# Altium schematic sheet Microcontroller.SchDoc
size A; Organization: Machine Intelligence Laboratory; Address1: 1889 Museum Rd; Address2: Room 3001; Address3: Gainesville, FL, 32611; SheetNumber: 2; SheetTotal: 4
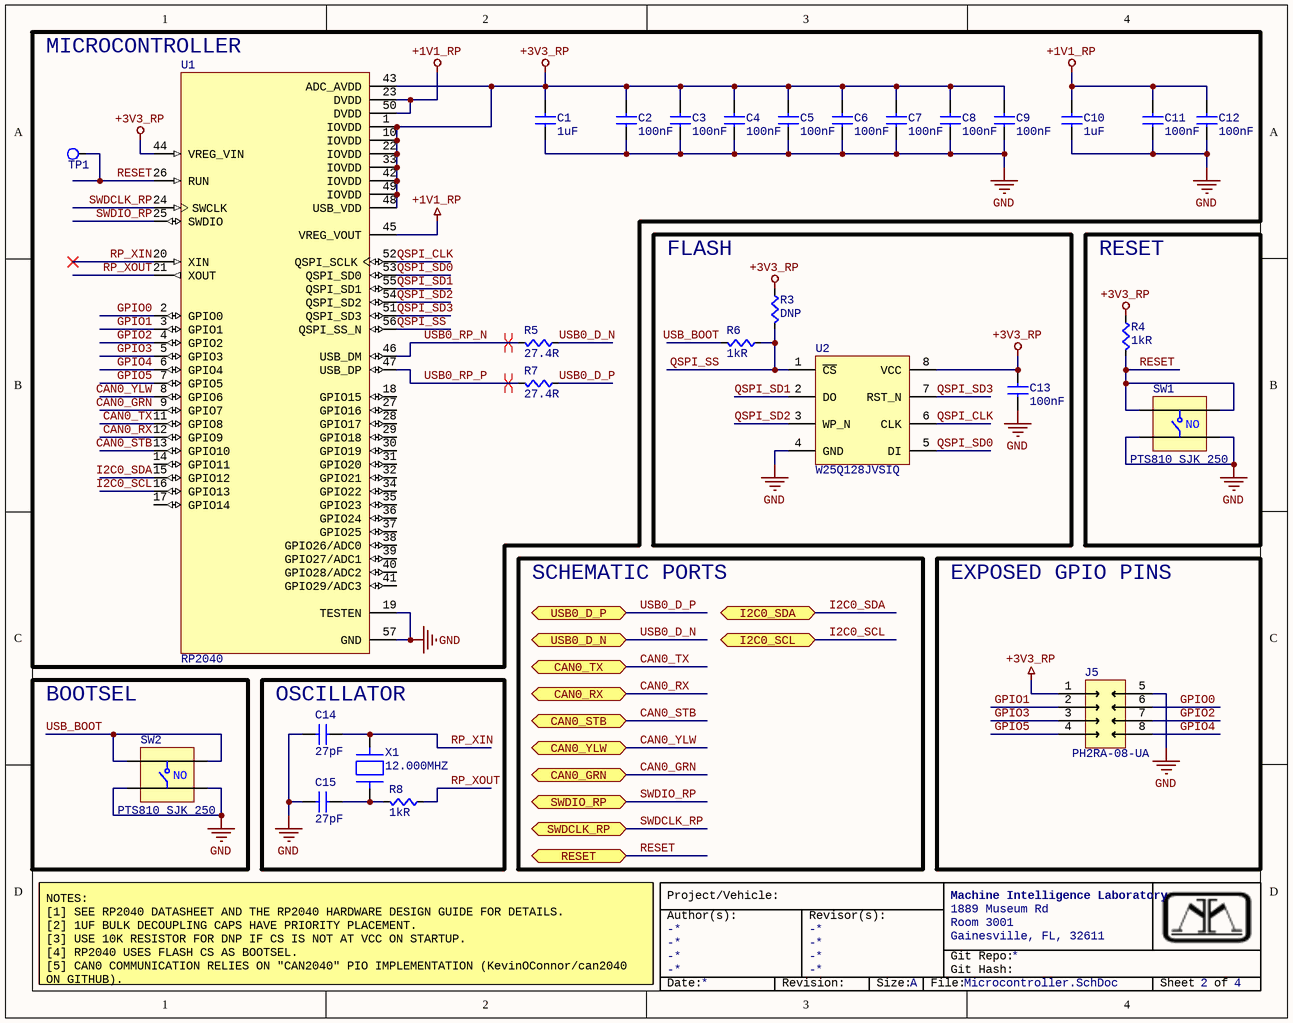
[diagram p0: Microcontroller.SchDoc]

## Parts
C1  1uF  [CAPC0603]
C2  100nF  [CAPC0603]
C3  100nF  [CAPC0603]
C4  100nF  [CAPC0603]
C5  100nF  [CAPC0603]
C6  100nF  [CAPC0603]
C7  100nF  [CAPC0603]
C8  100nF  [CAPC0603]
C9  100nF  [CAPC0603]
C10  1uF  [CAPC0603]
C11  100nF  [CAPC0603]
C12  100nF  [CAPC0603]
C13  100nF  [CAPC0603]
C14  27pF  [CAPC0603]
C15  27pF  [CAPC0603]
J5  PH2RA-08-UA  [PH2RA-08-UA]
R3  value DNP  [RES0603]  (hidden comment: Res)
R4  1kR  [RES0603]
R5  27.4R  [RES0603]
R6  1kR  [RES0603]
R7  27.4R  [RES0603]
R8  1kR  [RES0603]
SW1  PTS810 SJK 250  [SW_PTS810_SJM_250_SMTR_LFS]
SW2  PTS810 SJK 250  [SW_PTS810_SJM_250_SMTR_LFS]
TP1  TP  [TPAD-60MIL]  (value not drawn)  (no BOM)
U1  RP2040  [QFN40P700X700X90-57N]
U2  W25Q128JVSIQ  [SOIC127P790X216-8N]
X1  12.000MHZ  [ABLS-12.000MHZ]

## Blocks framed on the sheet
MICROCONTROLLER: C1-C12 R5 R7 TP1 U1
FLASH: C13 R3 R6 U2
RESET: R4 SW1
EXPOSED GPIO PINS: J5
BOOTSEL: SW2
OSCILLATOR: C14 C15 R8 X1

## Ports
CAN0_GRN (bidir, see Connectors[8A], Transceivers[3A]), CAN0_RX (bidir, see Transceivers[3A]), CAN0_STB (bidir, see Transceivers[3A]), CAN0_TX (bidir, see Transceivers[3A]), CAN0_YLW (bidir, see Connectors[8B], Transceivers[3A]), I2C0_SCL (bidir, see Connectors[8A]), I2C0_SDA (bidir, see Connectors[8A]), RESET (bidir, see Connectors[8A]), SWDCLK_RP (bidir, see Connectors[8A]), SWDIO_RP (bidir, see Connectors[8A]), USB0_D_N (bidir, see Connectors[8A]), USB0_D_P (bidir, see Connectors[8B])

## Nets
+1V1_RP: C10.2(B) C11.2(B) C12.2(B) U1.23(DVDD) U1.45(VREG_VOUT) U1.50(DVDD)
+3V3_RP: C1.2(B) C2.2(B) C3.2(B) C4.2(B) C5.2(B) C6.2(B) C7.2(B) C8.2(B) C9.2(B) C13.2(B) J5.1 R3.2(B) R4.2(B) U1.1(IOVDD) U1.10(IOVDD) U1.22(IOVDD) U1.33(IOVDD) U1.42(IOVDD) U1.43(ADC_AVDD) U1.44(VREG_VIN) U1.48(USB_VDD) U1.49(IOVDD) U2.8(VCC)
GND: C1.1(A) C2.1(A) C3.1(A) C4.1(A) C5.1(A) C6.1(A) C7.1(A) C8.1(A) C9.1(A) C10.1(A) C11.1(A) C12.1(A) C13.1(A) C14.1(A) C15.1(A) J5.5 SW1.3 SW1.4 SW2.3 SW2.4 U1.19(TESTEN) U1.57(GND) U2.4(GND)
CAN0_GRN: U1.9(GPIO7) ; port CAN0_GRN
CAN0_RX: U1.12(GPIO9) ; port CAN0_RX
CAN0_STB: U1.13(GPIO10) ; port CAN0_STB
CAN0_TX: U1.11(GPIO8) ; port CAN0_TX
CAN0_YLW: U1.8(GPIO6) ; port CAN0_YLW
GPIO0: J5.6 U1.2(GPIO0)
GPIO1: J5.2 U1.3(GPIO1)
GPIO2: J5.7 U1.4(GPIO2)
GPIO3: J5.3 U1.5(GPIO3)
GPIO4: J5.8 U1.6(GPIO4)
GPIO5: J5.4 U1.7(GPIO5)
I2C0_SCL: U1.16(GPIO13) ; port I2C0_SCL
I2C0_SDA: U1.15(GPIO12) ; port I2C0_SDA
QSPI_CLK: U1.52(QSPI_SCLK) U2.6(CLK)
QSPI_SD0: U1.53(QSPI_SD0) U2.5(DI)
QSPI_SD1: U1.55(QSPI_SD1) U2.2(DO)
QSPI_SD2: U1.54(QSPI_SD2) U2.3(WP_N)
QSPI_SD3: U1.51(QSPI_SD3) U2.7(RST_N)
QSPI_SS: R3.1(A) R6.2(B) U1.56(QSPI_SS_N) U2.1(~{CS})
RESET: R4.1(A) SW1.1 SW1.2 TP1.1 U1.26(RUN) ; port RESET
RP_XIN: C14.2(B) U1.20(XIN) X1.2
RP_XOUT: R8.2(B) U1.21(XOUT)
SWDCLK_RP: U1.24(SWCLK) ; port SWDCLK_RP
SWDIO_RP: U1.25(SWDIO) ; port SWDIO_RP
USB0_D_N: R5.2(B) ; port USB0_D_N
USB0_D_P: R7.2(B) ; port USB0_D_P
USB0_RP_N: R5.1(A) U1.46(USB_DM)
USB0_RP_P: R7.1(A) U1.47(USB_DP)
USB_BOOT: R6.1(A) SW2.1 SW2.2
NetC15_2: C15.2(B) R8.1(A) X1.1

Not connected (* = marked no-connect by the designer): U1 14(GPIO11) 17(GPIO14) 18(GPIO15) 27(GPIO16) 28(GPIO17) 29(GPIO18) 30(GPIO19) 31(GPIO20) 32(GPIO21) 34(GPIO22) 35(GPIO23) 36(GPIO24) 37(GPIO25) 38(GPIO26/ADC0) 39(GPIO27/ADC1) 40(GPIO28/ADC2) 41(GPIO29/ADC3)

## Layout directives
differential pair; net class USB0_RP; differential pair class USB0_RP_LINES; rule Matched Net Lengths [Tolerance = 10mil]; rule Differential Pairs Routing [Pref Gap = 4mil    Min Gap  = 4mil    Max Gap  = 5milPref Width = 6mil    Min Width  = 5mil    Max Width  = 6mil]: USB0_RP_N, USB0_RP_P

## Notes on the sheet
- SCHEMATIC PORTS
- NOTES:
  [1] SEE RP2040 DATASHEET AND THE RP2040 HARDWARE DESIGN GUIDE FOR DETAILS.
  [2] 1UF BULK DECOUPLING CAPS HAVE PRIORITY PLACEMENT.
  [3] USE 10K RESISTOR FOR DNP IF CS IS NOT AT VCC ON STARTUP.
  [4] RP2040 USES FLASH CS AS BOOTSEL.
  [5] CAN0 COMMUNICATION RELIES ON "CAN2040" PIO IMPLEMENTATION (KevinOConnor/can2040 ON GITHUB).
- Project/Vehicle:
- PLACE NOTES BOX HERE
- Author(s):
- -
- Revisor(s):
- Git Repo:
- Git Hash:
- Date:
- Revision:
- Size:
- A
- File:
- Sheet
- of
- (in symbol PTS810 SJK 250 SMTR LFS) NO

## Library data of the parts
C1 C10 = CC0603KRX7R7BB105: Ceramic Capacitor, Multilayer, Cera; Manufacturer: Yageo; Multilayer: Yes; Tolerance  (fill in as +-): 10%; Rated DC Voltage (URdc): 16V; Temperature Characteristics Code: X7R; Part Number: CC0603KRX7R7BB105; Category: Ceramic Capacitors; Stock 1: 9695416; Pricing 1: 1=0.1, 10=0.066, 50=0.0392, 100=0.0; Mounting Technology: Surface Mount; Pins: 2; Package Shape: Rectangular; Case/Package: 0603; Terminal Finish: Nickel; Min Operating Temperature: -55°C; Max Operating Temperature: 125°C; JESD-609 Code: e3; Packaging: Tape and Reel; Value: 1uF; Termination: Wraparound; Reach SVHC Compliant: Yes; RoHS Compliant: Yes; ComponentLink1URL: https://datasheet.ciiva.com:443/pdf; ComponentLink1Description: https://datasheet.ciiva.com:443/pdf; ComponentLink2URL: https://datasheet.ciiva.com/8033/17; ComponentLink2Description: https://datasheet.ciiva.com/8033/17; ComponentLink3URL: https://datasheet.ciiva.com/8033/17; ComponentLink3Description: https://datasheet.ciiva.com/8033/17; ComponentLink4URL: https://datasheet.ciiva.com/7978/14; ComponentLink4Description: https://datasheet.ciiva.com/7978/14; ComponentLink5URL: https://datasheet.ciiva.com/28450/1; ComponentLink5Description: https://datasheet.ciiva.com/28450/1; ComponentLink6URL: https://datasheet.ciiva.com/176/mlc; ComponentLink6Description: https://datasheet.ciiva.com/176/mlc; ComponentLink7URL: https://datasheet.ciiva.com/176/mlc; ComponentLink7Description: https://datasheet.ciiva.com/176/mlc; ComponentLink8URL: https://datasheet.ciiva.com/176/mlc; ComponentLink8Description: https://datasheet.ciiva.com/176/mlc; ComponentLink9URL: https://datasheet.ciiva.com/5425/up; ComponentLink9Description: https://datasheet.ciiva.com/5425/up; Supplier Part Number 1: 311-1446-1-ND; Manufacturer Part Number: CC0603KRX7R7BB105; RoHS: Yes; Package Style: SMTMeter; Supplier 1: Digikey; Dielectric Material: Ceramic; Capacitor Type: Ceramic; Tolerance (fill in as +-): 10%; Length: 1.6mm; Width: 0.8mm; Height: 0.8mm
C2-C9 C11-C13 = CC0603KRX7R7BB104: Ceramic Capacitor, Multilayer, Cera; Manufacturer: Yageo; Multilayer: Yes; Tolerance  (fill in as +-): 10%; Rated DC Voltage (URdc): 16V; Temperature Characteristics Code: X7R; Part Number: CC0603KRX7R7BB104; Category: Ceramic Capacitors; Stock 1: 11347706; Pricing 1: 1=0.1, 10=0.042, 50=0.0238, 100=0.0; Mounting Technology: Surface Mount; Pins: 2; Package Shape: Rectangular; Case/Package: 0603; Terminal Finish: Nickel; Min Operating Temperature: -55°C; Max Operating Temperature: 125°C; JESD-609 Code: e3; Packaging: Tape and Reel; Value: 100nF; Termination: Wraparound; Reach SVHC Compliant: Yes; RoHS Compliant: Yes; ComponentLink1URL: https://datasheet.ciiva.com:443/pdf; ComponentLink1Description: https://datasheet.ciiva.com:443/pdf; ComponentLink2URL: https://datasheet.ciiva.com/11786/0; ComponentLink2Description: https://datasheet.ciiva.com/11786/0; ComponentLink3URL: https://datasheet.ciiva.com/8033/70; ComponentLink3Description: https://datasheet.ciiva.com/8033/70; ComponentLink4URL: https://datasheet.ciiva.com/7978/14; ComponentLink4Description: https://datasheet.ciiva.com/7978/14; ComponentLink5URL: https://datasheet.ciiva.com/28450/1; ComponentLink5Description: https://datasheet.ciiva.com/28450/1; ComponentLink6URL: https://datasheet.ciiva.com/46430/1; ComponentLink6Description: https://datasheet.ciiva.com/46430/1; ComponentLink7URL: https://datasheet.ciiva.com/144/mlc; ComponentLink7Description: https://datasheet.ciiva.com/144/mlc; ComponentLink8URL: https://datasheet.ciiva.com/144/mlc; ComponentLink8Description: https://datasheet.ciiva.com/144/mlc; ComponentLink9URL: https://datasheet.ciiva.com/144/mlc; ComponentLink9Description: https://datasheet.ciiva.com/144/mlc; Supplier Part Number 1: 311-1088-1-ND; Manufacturer Part Number: CC0603KRX7R7BB104; RoHS: Yes; Package Style: SMTMeter; Supplier 1: Digikey; Dielectric Material: Ceramic; Capacitor Type: Ceramic; Tolerance (fill in as +-): 10%; Length: 1.6mm; Width: 0.8mm; Height: 0.8mm; ComponentLink10URL: https://datasheet.ciiva.com/8033/17; ComponentLink10Description: https://datasheet.ciiva.com/8033/17; ComponentLink11URL: https://datasheet.ciiva.com/13395/u; ComponentLink11Description: https://datasheet.ciiva.com/13395/u; ComponentLink12URL: https://datasheet.ciiva.com/11464/u; ComponentLink12Description: https://datasheet.ciiva.com/11464/u; ComponentLink13URL: https://datasheet.ciiva.com/15165/g; ComponentLink13Description: https://datasheet.ciiva.com/15165/g; ComponentLink14URL: https://datasheet.ciiva.com:443/pdfs/VipMasterIC/IC/YAGO/YAGO-S-A0003557223; ComponentLink14Description: https://datasheet.ciiva.com:443/pdfs/VipMasterIC/IC/YAGO/YAGO-S-A0003557223; ComponentLink15URL: https://datasheet.ciiva.com/11786/0900766b80d84f1d-11786077.pdf?src-supplie; ComponentLink15Description: https://datasheet.ciiva.com/11786/0900766b80d84f1d-11786077.pdf?src-supplie; ComponentLink16URL: https://datasheet.ciiva.com/8033/70765-8033799.pdf?src-supplier=Element14; ComponentLink16Description: https://datasheet.ciiva.com/8033/70765-8033799.pdf?src-supplier=Element14; ComponentLink17URL: https://datasheet.ciiva.com/7978/1489800-7978141.pdf?src-supplier=Element14; ComponentLink17Description: https://datasheet.ciiva.com/7978/1489800-7978141.pdf?src-supplier=Element14; ComponentLink18URL: https://datasheet.ciiva.com/28450/1489800-28450552.pdf?src-supplier=Element
C14 C15 = CC0603JRNPO9BN270: Ceramic Capacitor, Multilayer, Cera; Manufacturer: Yageo; Multilayer: Yes; Tolerance  (fill in as +-): 5%; Rated DC Voltage (URdc): 50V; Temperature Characteristics Code: C0G; Part Number: CC0603JRNPO9BN270; Category: Ceramic Capacitors; Stock 1: 110865; Pricing 1: 1=0.1, 10=0.033, 50=0.0188, 100=0.0; Mounting Technology: Surface Mount; Pins: 2; Package Shape: Rectangular; Case/Package: 0603; Terminal Finish: Nickel; Min Operating Temperature: -55°C; Max Operating Temperature: 125°C; JESD-609 Code: e3; Packaging: Tape and Reel; Value: 27pF; Termination: Wraparound; Reach SVHC Compliant: Yes; RoHS Compliant: Yes; ComponentLink1URL: https://datasheet.ciiva.com:443/pdf; ComponentLink1Description: https://datasheet.ciiva.com:443/pdf; ComponentLink2URL: https://datasheet.ciiva.com/26862/g; ComponentLink2Description: https://datasheet.ciiva.com/26862/g; ComponentLink3URL: https://datasheet.ciiva.com/8033/14; ComponentLink3Description: https://datasheet.ciiva.com/8033/14; ComponentLink4URL: https://datasheet.ciiva.com/46430/1; ComponentLink4Description: https://datasheet.ciiva.com/46430/1; ComponentLink5URL: https://datasheet.ciiva.com/144/mlc; ComponentLink5Description: https://datasheet.ciiva.com/144/mlc; ComponentLink6URL: https://datasheet.ciiva.com/144/mlc; ComponentLink6Description: https://datasheet.ciiva.com/144/mlc; ComponentLink7URL: https://datasheet.ciiva.com/144/mlc; ComponentLink7Description: https://datasheet.ciiva.com/144/mlc; ComponentLink8URL: https://datasheet.ciiva.com/8033/17; ComponentLink8Description: https://datasheet.ciiva.com/8033/17; ComponentLink9URL: https://datasheet.ciiva.com/8033/17; ComponentLink9Description: https://datasheet.ciiva.com/8033/17; Supplier Part Number 1: 311-1063-1-ND; Manufacturer Part Number: CC0603JRNPO9BN270; RoHS: Yes; Package Style: SMTMeter; Supplier 1: Digikey; Dielectric Material: Ceramic; Capacitor Type: Ceramic; Tolerance (fill in as +-): 5%; Length: 1.6mm; Width: 0.8mm; Height: 0.8mm; ComponentLink10URL: https://datasheet.ciiva.com/11464/u; ComponentLink10Description: https://datasheet.ciiva.com/11464/u
J5 = PH2RA-08-UA: Connector Header Through Hole, Right Angle 8 position 0.100" (2.54mm); Supplier 1: Digikey; Supplier Part Number 1: 2057-PH2RA-08-UA-ND
R4 R6 R8 = RC0603FR-071KL: Fixed Resistor, Metal Glaze/thick F; Manufacturer: Yageo; Power: 100mW; Rated Temperature: 70°C; Tolerance: 1%; Additional Feature: LASER TRIMMABLE; Temperature Coefficient: 100ppm/°C; Working Voltage: 75V; Package Height: 0.45mm; Package Length: 1.6mm; Package Width: 0.8mm; Part Number: RC0603FR-071KL; Category: Chip SMD Resistors; Stock 1: 11540000; Pricing 1: 5000=0.0015, 50000=0.0014, 150000=0; Mounting Technology: Surface Mount; Pins: 2; Package Shape: Rectangular; Case/Package: 0603; Terminal Finish: Nickel; Min Operating Temperature: -55°C; Max Operating Temperature: 155°C; JESD-609 Code: e3; Resistor Type: FIXED RESISTOR; Packaging: Tape and Reel; Value: 1kR; Termination: Wraparound; Technology: METAL GLAZE/THICK FILM; Reach SVHC Compliant: Yes; RoHS Compliant: Yes; ComponentLink1URL: https://datasheet.ciiva.com:443/pdf; ComponentLink1Description: https://datasheet.ciiva.com:443/pdf; ComponentLink2URL: https://datasheet.ciiva.com/11808/0; ComponentLink2Description: https://datasheet.ciiva.com/11808/0; ComponentLink3URL: https://datasheet.ciiva.com/7746/16; ComponentLink3Description: https://datasheet.ciiva.com/7746/16; ComponentLink4URL: https://datasheet.ciiva.com/7660/18; ComponentLink4Description: https://datasheet.ciiva.com/7660/18; ComponentLink5URL: https://datasheet.ciiva.com/7983/44; ComponentLink5Description: https://datasheet.ciiva.com/7983/44; ComponentLink6URL: https://datasheet.ciiva.com/7746/17; ComponentLink6Description: https://datasheet.ciiva.com/7746/17; ComponentLink7URL: https://datasheet.ciiva.com/7746/17; ComponentLink7Description: https://datasheet.ciiva.com/7746/17; ComponentLink8URL: https://datasheet.ciiva.com/8896/py; ComponentLink8Description: https://datasheet.ciiva.com/8896/py; ComponentLink9URL: https://datasheet.ciiva.com/15189/g; ComponentLink9Description: https://datasheet.ciiva.com/15189/g; Supplier Part Number 1: 4016291; Manufacturer Part Number: RC0603FR-071KL; RoHS: Yes; Construction: Chip; Package Style: SMTMeter
R5 R7 = RC0603FR-0727R4L: Fixed Resistor, Metal Glaze/thick F; Manufacturer: Yageo; Power: 100mW; Rated Temperature: 70°C; Tolerance: 1%; Additional Feature: LASER TRIMMABLE; Temperature Coefficient: 100ppm/°C; Working Voltage: 75V; Package Height: 0.45mm; Package Length: 1.6mm; Package Width: 0.8mm; Part Number: RC0603FR-0727R4L; Category: Chip SMD Resistors; Stock 1: 178500; Pricing 1: 1=0.1, 10=0.02, 50=0.0124, 100=0.01; Mounting Technology: Surface Mount; Pins: 2; Package Shape: Rectangular; Case/Package: 0603; Terminal Finish: Nickel; Min Operating Temperature: -55°C; Max Operating Temperature: 155°C; JESD-609 Code: e3; Resistor Type: FIXED RESISTOR; Packaging: Tape and Reel; Value: 27.4R; Termination: Wraparound; Technology: METAL GLAZE/THICK FILM; Reach SVHC Compliant: Yes; RoHS Compliant: Yes; ComponentLink1URL: https://datasheet.ciiva.com:443/pdf; ComponentLink1Description: https://datasheet.ciiva.com:443/pdf; ComponentLink2URL: https://datasheet.ciiva.com/2454/py; ComponentLink2Description: https://datasheet.ciiva.com/2454/py; ComponentLink3URL: https://datasheet.ciiva.com/2454/py; ComponentLink3Description: https://datasheet.ciiva.com/2454/py; ComponentLink4URL: https://datasheet.ciiva.com/2454/py; ComponentLink4Description: https://datasheet.ciiva.com/2454/py; ComponentLink5URL: https://datasheet.ciiva.com/8889/py; ComponentLink5Description: https://datasheet.ciiva.com/8889/py; ComponentLink6URL: https://datasheet.ciiva.com/15160/g; ComponentLink6Description: https://datasheet.ciiva.com/15160/g; Supplier Part Number 1: 311-27.4HRCT-ND; Manufacturer Part Number: RC0603FR-0727R4L; RoHS: Yes; Construction: Chip; Package Style: SMTMeter; Supplier 1: Digikey
SW1 SW2 = PTS810 SJK 250 SMTR LFS: Tactile Switch SPST-NO Top Actuated Surface Mount; Supplier 1: Digikey; Supplier Part Number 1: CKN10503CT-ND
U1 = SC0914(13): ARM® Cortex®-M0+ - Microcontroller IC 32-Bit Dual-Core 133MHz External Program Memory 56-QFN (7x7); MF: Raspberry Pi; SnapEDA_Link: https://www.snapeda.com/parts/SC0914(13)/Raspberry+Pi/view-part/?ref=snap; Package: VFQFN-56 Raspberry Pi; Value: *; MP: SC0914(13); Check_prices: https://www.snapeda.com/parts/SC0914(13)/Raspberry+Pi/view-part/?ref=eda; Supplier 1: Digikey; Supplier Part Number 1: 2648-SC0914(13)CT-ND
U2 = W25Q128JVSIQ: FLASH - NOR Memory IC 128Mbit SPI - Quad I/O, QPI, DTR 133 MHz 8-SOIC; Supplier 1: Digikey; Supplier Part Number 1: W25Q128JVSIQCT-ND
X1 = ABLS-12.000MHZ: 12 MHz ±20ppm Crystal 18pF 50 Ohms HC-49/US; Supplier 1: Digikey; Supplier Part Number 1: 535-9067-1-ND
R3 = Res: Supplier 1: Digi-Key; Supplier Part Number 1: RMCF0603JT10K0CT-ND